# Altium schematic sheet Demux.SchDoc: QUTMS Shutdown V2 - Demux
size A4; Organization: QUT Motorsport; Address1: O-120; Address2: O Block; Address3: QUT Gardnes Point; Address4: Brisbane, 4000; DocumentNumber: 4; SheetNumber: 4; SheetTotal: 13
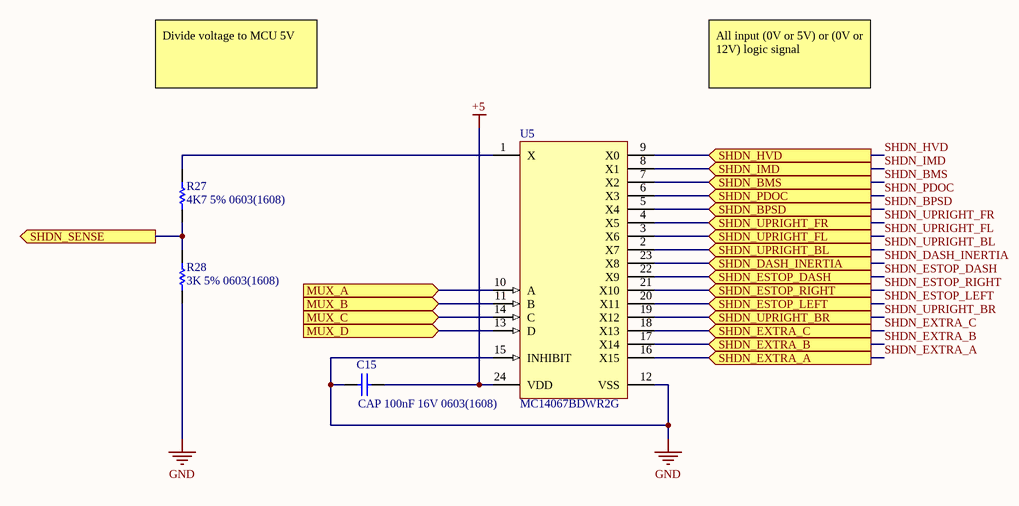
[diagram p0: Demux.SchDoc]

## Parts
C15  CAP 100nF 16V 0603(1608)  [CAPC0603(1608)100_M]
R27  4K7 5% 0603(1608)  [RESC0603(1608)_N]
R28  3K 5% 0603(1608)  [RESC0603(1608)_M]
U5  MC14067BDWR2G  [ONSC-SOIC-24-751E-04_V]

## Ports
MUX_A (in), MUX_B (in), MUX_C (in), MUX_D (in), SHDN_BMS (in), SHDN_BPSD (in), SHDN_DASH_INERTIA (in), SHDN_ESTOP_DASH (in), SHDN_ESTOP_LEFT (in), SHDN_ESTOP_RIGHT (in), SHDN_EXTRA_A (in), SHDN_EXTRA_B (in), SHDN_EXTRA_C (in), SHDN_HVD (in), SHDN_IMD (in), SHDN_PDOC (in), SHDN_SENSE (out), SHDN_UPRIGHT_BL (in), SHDN_UPRIGHT_BR (in), SHDN_UPRIGHT_FL (in), SHDN_UPRIGHT_FR (in)

## Nets
+5: C15.2 U5.24(VDD)
GND: C15.1 R28.1 U5.12(VSS) U5.15(INHIBIT)
MUX_A: U5.10(A) ; port MUX_A
MUX_B: U5.11(B) ; port MUX_B
MUX_C: U5.14(C) ; port MUX_C
MUX_D: U5.13(D) ; port MUX_D
SHDN_BMS: U5.7(X2) ; port SHDN_BMS
SHDN_BPSD: U5.5(X4) ; port SHDN_BPSD
SHDN_DASH_INERTIA: U5.23(X8) ; port SHDN_DASH_INERTIA
SHDN_ESTOP_DASH: U5.22(X9) ; port SHDN_ESTOP_DASH
SHDN_ESTOP_LEFT: U5.20(X11) ; port SHDN_ESTOP_LEFT
SHDN_ESTOP_RIGHT: U5.21(X10) ; port SHDN_ESTOP_RIGHT
SHDN_EXTRA_A: U5.16(X15) ; port SHDN_EXTRA_A
SHDN_EXTRA_B: U5.17(X14) ; port SHDN_EXTRA_B
SHDN_EXTRA_C: U5.18(X13) ; port SHDN_EXTRA_C
SHDN_HVD: U5.9(X0) ; port SHDN_HVD
SHDN_IMD: U5.8(X1) ; port SHDN_IMD
SHDN_PDOC: U5.6(X3) ; port SHDN_PDOC
SHDN_SENSE: R27.1 R28.2 ; port SHDN_SENSE
SHDN_UPRIGHT_BL: U5.2(X7) ; port SHDN_UPRIGHT_BL
SHDN_UPRIGHT_BR: U5.19(X12) ; port SHDN_UPRIGHT_BR
SHDN_UPRIGHT_FL: U5.3(X6) ; port SHDN_UPRIGHT_FL
SHDN_UPRIGHT_FR: U5.4(X5) ; port SHDN_UPRIGHT_FR
NetR27_2: R27.2 U5.1(X)

## Notes on the sheet
- Divide voltage to MCU 5V
- All input (0V or 5V) or (0V or 12V) logic signal
- Title
- Size:
- Date:
- A4
- Number:
- Time:
- Revision:
- Sheet
- of
- File:

## Library data of the parts
C15 = CMP-1035-02583-1: CAP 100nF 16V ±5% 0603 (1608 Metric) Thickness 1mm SMD; Tolerance: Â±5%; Case-Metric: 1608; Case-EIA: 0603; Rated Voltage: 16 V; Max Thickness: 1 mm; Technology: SMT; Value: 100nF
R27 = CMP-1012-00090-1: 4K7 0.1W 5% 0603 (1608 Metric)  SMD; Case-Metric: 1608; Value: 4700.00 Ohm; Case-EIA: 0603; Tolerance: 5 %; Technology: SMT; Power: 0.1 W
R28 = CMP-1012-00085-1: 3K 0.1W 5% 0603 (1608 Metric)  SMD; Case-EIA: 0603; Case-Metric: 1608; Value: 3000.00 Ohm; Power: 0.1 W; Tolerance: 5 %; Technology: SMT
U5 = CMP-1307-00132-1: Analog Multiplexer / Demultiplexer, 3 to 18 V, -55 to 125 degC, 24-Pin SOIC, Pb-Free, Tape and Reel; Manufacturer: On Semiconductor; VCC Min (V): 3; Icc Max (uA): 600; VCC Max (V): 18; PackageReference: SOIC-24-751E-04; DatasheetVersion: Rev. 8; ComponentLink2URL: http://www.onsemi.com/pub_link/Collateral/MC14067B-D.PDF; ComponentLink3URL: http://www.onsemi.com/pub_link/Collateral/751E-04.PDF; Mounting Technology: Surface Mount; PackageDescription: 24-Pin Small Outline Integrated Circuit, Body 15.4 x 7.5 mm, Pitch 1.27 mm; ComponentLink3Description: Package Specification; ComponentLink1URL: http://www.onsemi.com/; ComponentLink2Description: Datasheet; RoHS: TRUE; Packing: Tape and Reel; ComponentLink1Description: Manufacturer URL; PartNumber: MC14067BDWR2G; PackageVersion: Rev. F, 07/2012